# EAGLE design bat_charger (EAGLE 9.6.2)
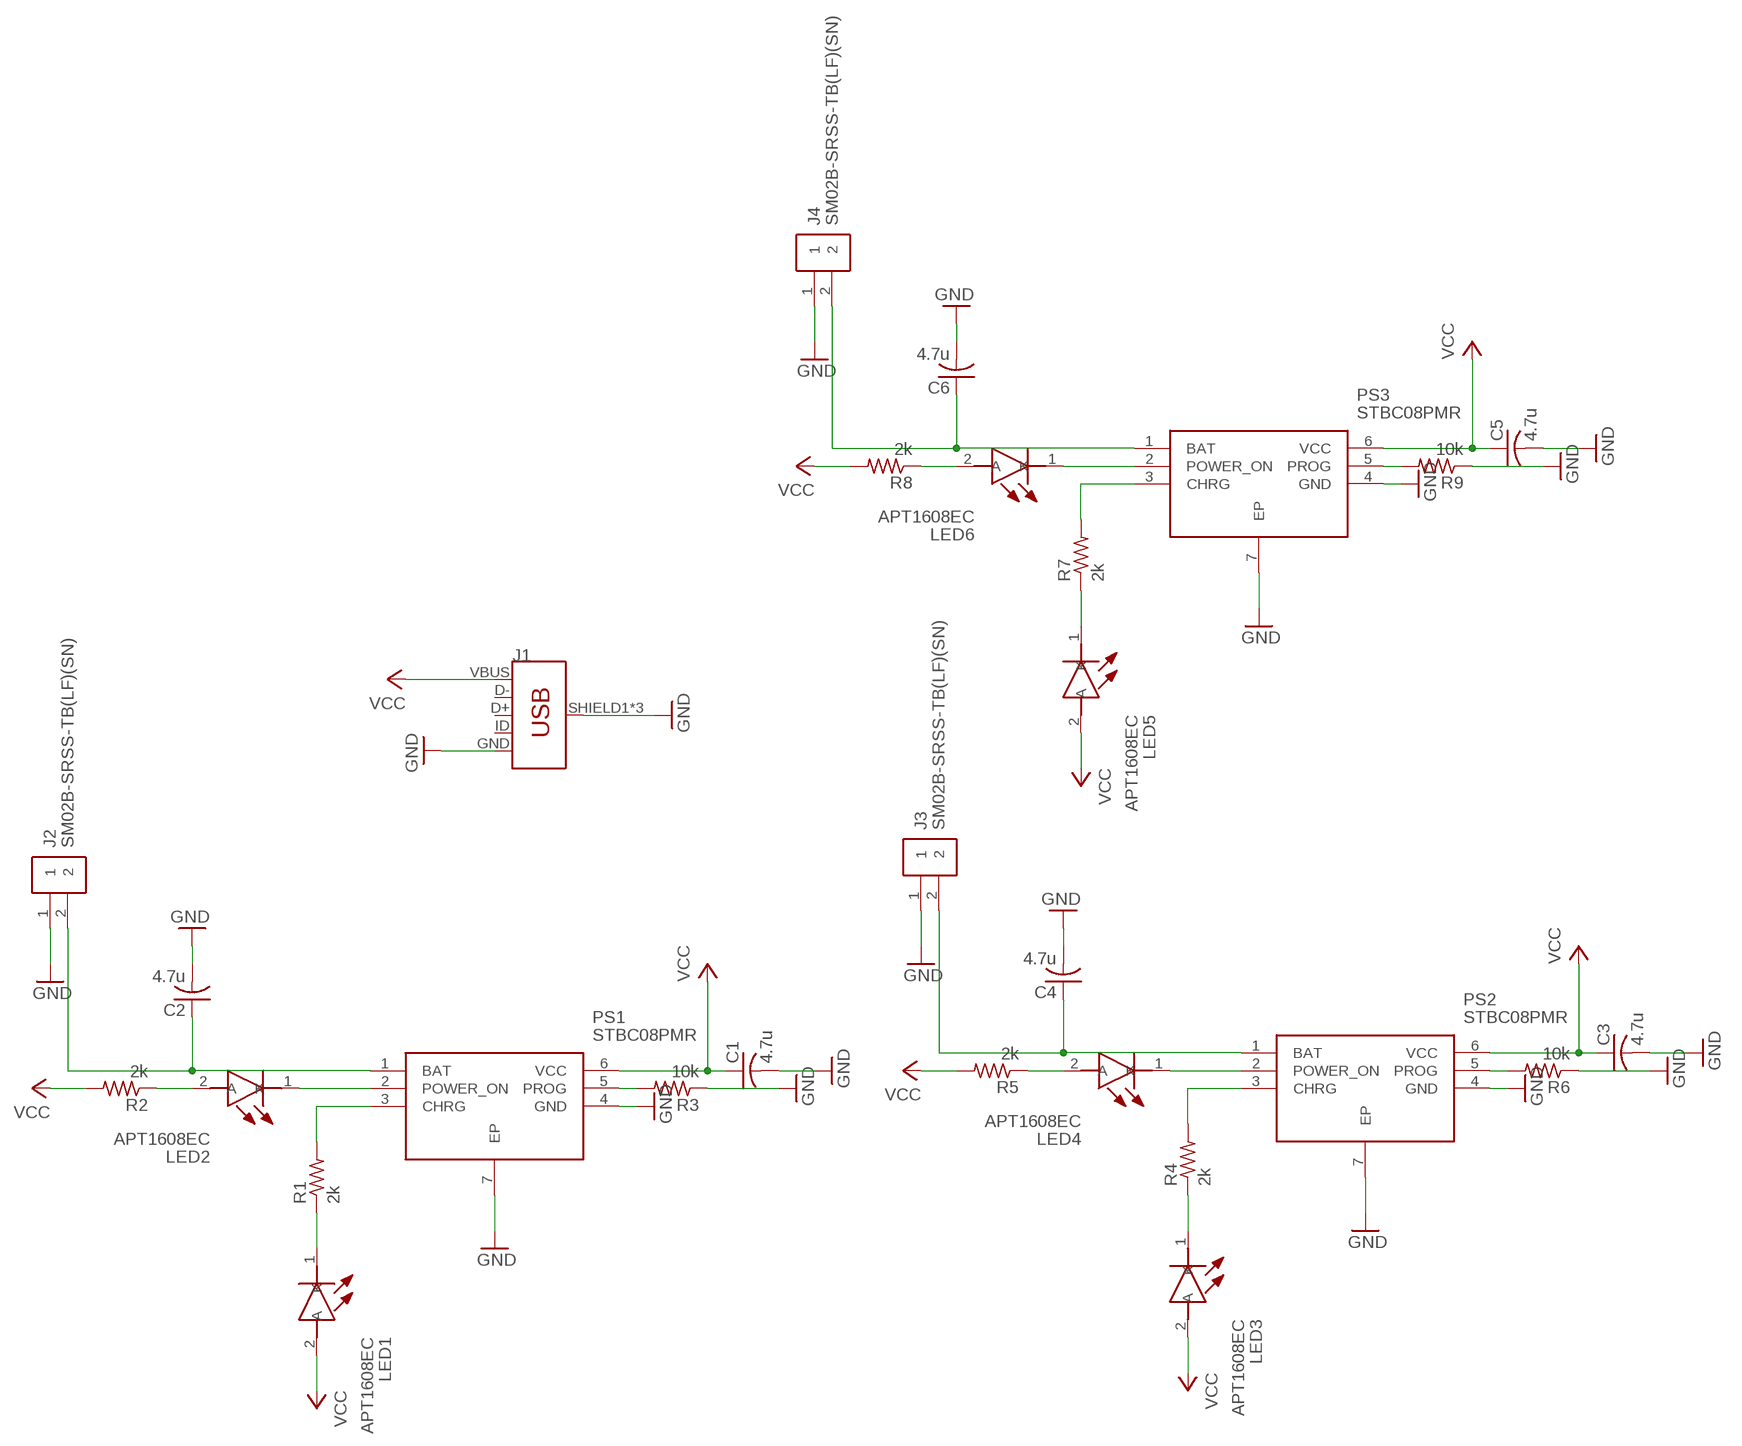
[diagram p0: schematic, sheet 1]

## Parts
C1  4.7u  C-USC0603  [C0603]
C2  4.7u  C-USC0603  [C0603]
C3  4.7u  C-USC0603  [C0603]
C4  4.7u  C-USC0603  [C0603]
C5  4.7u  C-USC0603  [C0603]
C6  4.7u  C-USC0603  [C0603]
J1  USB_MICRO-B_FEMALE-SMT  [USB-B-MICRO-SMD]
J2  SM02B-SRSS-TB(LF)(SN)  [SM02B-SRSS-TB(LF)(SN)]
J3  SM02B-SRSS-TB(LF)(SN)  [SM02B-SRSS-TB(LF)(SN)]
J4  SM02B-SRSS-TB(LF)(SN)  [SM02B-SRSS-TB(LF)(SN)]
LED1  APT1608EC  [LEDC1608X85N]
LED2  APT1608EC  [LEDC1608X85N]
LED3  APT1608EC  [LEDC1608X85N]
LED4  APT1608EC  [LEDC1608X85N]
LED5  APT1608EC  [LEDC1608X85N]
LED6  APT1608EC  [LEDC1608X85N]
PS1  STBC08PMR  [SON95P300X300X100-7N]
PS2  STBC08PMR  [SON95P300X300X100-7N]
PS3  STBC08PMR  [SON95P300X300X100-7N]
R1  2k  R-US_R0603  [R0603]
R2  2k  R-US_R0603  [R0603]
R3  10k  R-US_R0603  [R0603]
R4  2k  R-US_R0603  [R0603]
R5  2k  R-US_R0603  [R0603]
R6  10k  R-US_R0603  [R0603]
R7  2k  R-US_R0603  [R0603]
R8  2k  R-US_R0603  [R0603]
R9  10k  R-US_R0603  [R0603]

## Nets
GND [pwr]: C1.2 C2.2 C3.2 C4.2 C5.2 C6.2 J1.GND J1.SHIELD1(SHIELD) J1.SHIELD2(SHIELD) J1.SHIELD3(SHIELD) J2.1 J3.1 J4.1 PS1.4(GND) PS1.7(EP) PS2.4(GND) PS2.7(EP) PS3.4(GND) PS3.7(EP) R3.1 R6.1 R9.1
N$1: PS1.3(CHRG) R1.2
N$2: LED1.1(K) R1.1
N$3: C2.1 J2.2 PS1.1(BAT)
N$4: LED2.1(K) PS1.2(POWER_ON)
N$5: LED2.2(A) R2.1
N$6: PS1.5(PROG) R3.2
N$7: PS2.3(CHRG) R4.2
N$8: LED3.1(K) R4.1
N$9: LED4.1(K) PS2.2(POWER_ON)
N$10: LED4.2(A) R5.1
N$11: PS2.5(PROG) R6.2
N$12 [pwr]: C4.1 J3.2 PS2.1(BAT)
N$13: PS3.3(CHRG) R7.2
N$14: LED5.1(K) R7.1
N$15: LED6.1(K) PS3.2(POWER_ON)
N$16: LED6.2(A) R8.1
N$17: PS3.5(PROG) R9.2
N$18 [pwr]: C6.1 J4.2 PS3.1(BAT)
VCC [pwr]: C1.1 C3.1 C5.1 J1.VBUS LED1.2(A) LED3.2(A) LED5.2(A) PS1.6(VCC) PS2.6(VCC) PS3.6(VCC) R2.2 R5.2 R8.2
Unconnected: J1.D+ J1.D- J1.ID

## Library data of the parts
C1-C6 = adafruit:C-US: CAPACITOR, American symbol
J1 = SparkFun-Connectors:USB_MICRO-B: USB Type Micro-B Connector Male/female and PTH/SMT variants SparkFun Products: SparkFun microB USB Breakout <https://www.sparkfun.com/products/12035> SparkFun USB microB Plug Breakout <https://www.sparkfun.com/products/10031> SparkFun ESP8266 Thing <https://www.sparkfun.com/products/13231>; PROD_ID: CONN-11752
J2-J4 = SM02B-SRSS-TB_LF__SN_:SM02B-SRSS-TB(LF)(SN): JST (JAPAN SOLDERLESS TERMINALS) - SM02B-SRSS-TB (LF)(SN) - HEADER, R/A, 2WAY Source: Datasheet <http://www.jst-mfg.com/product/pdf/eng/eSH.pdf> Check availability <https://pricing.snapeda.com/parts/SM02B-SRSS-TB%28LF%29%28SN%29/JST%20Sales/view-part?ref=eda>; AVAILABILITY: In Stock; DESCRIPTION: Connector Header Surface Mount, Right Angle 2 position 0.039 (1.00mm); MF: JST Sales; MP: SM02B-SRSS-TB(LF)(SN); PACKAGE: None; PRICE: None; PURCHASE-URL: https://pricing.snapeda.com/search/part/SM02B-SRSS-TB(LF)(SN)/?ref=eda
LED1-LED6 = APT1608EC:APT1608EC: Standard LEDs - SMD HI EFF RED WTR CLR Source: Datasheet <http://docs-emea.rs-online.com/webdocs/142e/0900766b8142ead4.pdf>; ARROW_PART_NUMBER: APT1608EC; ARROW_PRICE-STOCK: https://www.arrow.com/en/products/apt1608ec/kingbright; DESCRIPTION: Standard LEDs - SMD HI EFF RED WTR CLR; HEIGHT: 0.85mm; MANUFACTURER_NAME: Kingbright; MANUFACTURER_PART_NUMBER: APT1608EC; MOUSER_PART_NUMBER: 604-APT1608EC; MOUSER_PRICE-STOCK: https://www.mouser.co.uk/ProductDetail/Kingbright/APT1608EC?qs=y3UkhjaxUTbvcINjaB1ATQ%3D%3D
PS1-PS3 = STBC08PMR:STBC08PMR: STMicroelectronics STBC08PMR, Battery Charger, 800mA, 6-Pin DFN Source: Datasheet <https://componentsearchengine.com/Datasheets/2/STBC08PMR.pdf>; ARROW_PART_NUMBER: STBC08PMR; ARROW_PRICE-STOCK: https://www.arrow.com/en/products/stbc08pmr/stmicroelectronics; DESCRIPTION: STMicroelectronics STBC08PMR, Battery Charger, 800mA, 6-Pin DFN; HEIGHT: 1mm; MANUFACTURER_NAME: STMicroelectronics; MANUFACTURER_PART_NUMBER: STBC08PMR; MOUSER_PART_NUMBER: 511-STBC08PMR; MOUSER_PRICE-STOCK: https://www.mouser.co.uk/ProductDetail/STMicroelectronics/STBC08PMR?qs=%252BFmDY%2FmH7Ia1jfeGRWsaYw%3D%3D
R1-R9 = adafruit:R-US_: RESISTOR, American symbol

## Net classes
1 pwr: width 0.254 mm

## Board
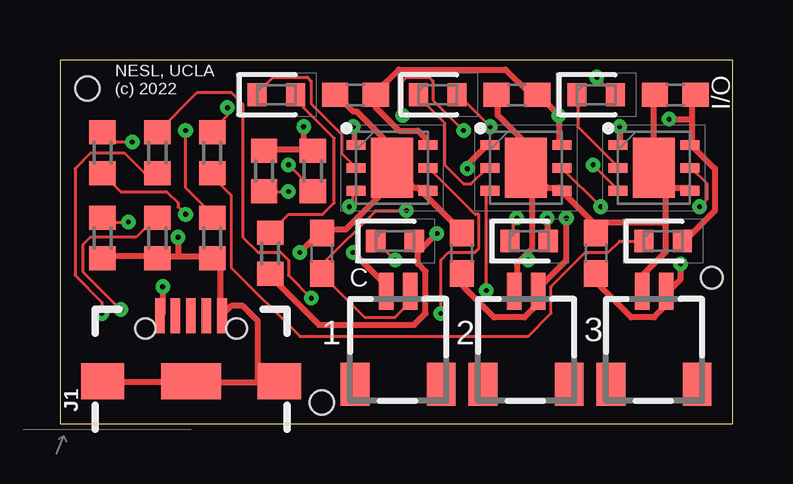
[diagram p1: board, top side]
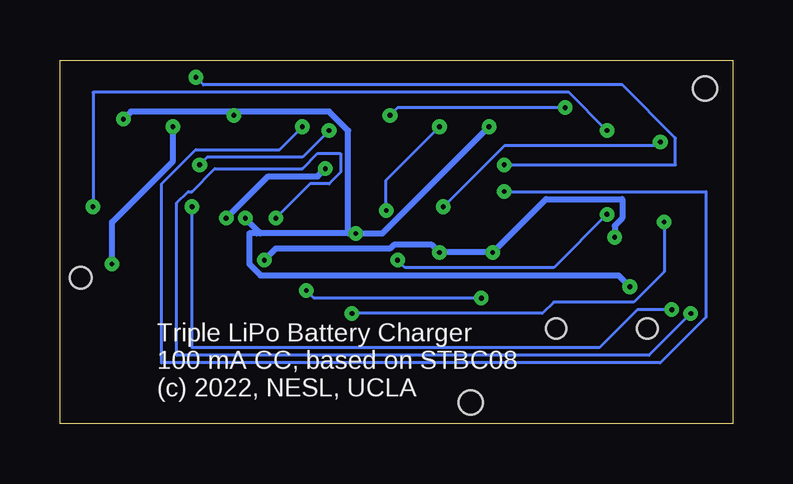
[diagram p2: board, bottom side, seen from below]

Size 28.05 x 15.16 mm. Coordinates in mm from the lower left corner, seen from the top.
Outline: 0,0 28.05,0 28.05,15.16 0,15.16 0,0
Copper layers (1*16): Top 0.035mm / dielectric 1.5mm / Bottom 0.035mm
Design rules "default *": minimum track width 5mil, minimum drill 0.2mm, track to track 5mil, track to pad 5mil, pad to pad 5mil, via to via 5mil, smd to smd 5mil, copper to edge 10mil, drill to drill 5mil, minimum pad ring 10mil, minimum via ring 8mil, stop-mask expansion 4mil, vias tented up to drill 0mil, thermal gap 10mil
Holes 0.9 mm at 27.18,6.1
Holes 1 mm at 1.14,13.97 10.92,0.89

### Footprints (pad centres in the part's own frame; a part is rotated, then mirrored left to right if it is on the bottom)
C0603 = smd 1.1 x 1: 1 -0.85,0; 2 0.85,0
USB-B-MICRO-SMD = smd 1.45 x 0.4: D+ 2.725,0; D- 2.725,0.65; GND 2.725,-1.3; ID 2.725,-0.65; VBUS 2.725,1.3 | smd 1.5 x 1.8: SHIELD1 0,3.685; SHIELD2 0,-3.685 | smd 1.5 x 2.5: SHIELD3 0,0 | hole 0.85: 2.2,1.9; 2.2,-1.9
SM02B-SRSS-TB(LF)(SN) = smd 0.6 x 1.55: 1 -0.5,1.975; 2 0.5,1.975 | smd 1.2 x 1.8: 3 -1.8,-1.9; 4 1.8,-1.9
LEDC1608X85N = smd 0.8 x 0.95: 1 -0.8,0; 2 0.8,0
SON95P300X300X100-7N = smd 0.8 x 0.4: 1 -1.5,0.95; 2 -1.5,0; 3 -1.5,-0.95; 4 1.5,-0.95; 5 1.5,0; 6 1.5,0.95 | smd 1.75 x 2.5: 7 0,0
R0603 = smd 1 x 1.1: 1 -0.85,0; 2 0.85,0

### Placement (x,y rotation side)
C1  12.32,13.72 180 top
C2  10.92,7.11 90 top
C3  19.05,13.72 180 top
C4  16.76,7.11 90 top
C5  25.65,13.72 180 top
C6  22.35,7.11 90 top
J1  5.46,1.78 90 top
J2  14.1,3.56 0 top
J3  19.43,3.56 0 top
J4  24.76,3.56 0 top
LED1  13.97,7.62 0 top
LED2  9.02,13.72 0 top
LED3  19.56,7.62 0 top
LED4  15.75,13.72 0 top
LED5  25.15,7.62 0 top
LED6  22.35,13.72 0 top
PS1  13.84,10.67 0 top
PS2  19.43,10.67 0 top
PS3  24.76,10.67 0 top
R1  1.78,11.3 90 top
R2  8.76,7.11 270 top
R3  1.78,7.75 90 top
R4  4.06,11.3 90 top
R5  8.51,10.54 90 top
R6  4.06,7.75 90 top
R7  6.35,11.3 90 top
R8  10.54,10.54 90 top
R9  6.35,7.75 90 top

### Tracks (layer width: path | path; a pad name or v marks a point on that pad's centre or on a via)
GND  (via drill 0.2)
  Top 0.254: PS3.4 26.19,9.84 25.56,9.84 24.76,10.64 PS3.7 | PS3.7 24.76,13.65 C5.2 | 25.24,8.41 25.24,10 PS3.7 | 25.24,8.41 25.24,7.14 24.29,6.19 24.29,5.56 J4.1 | PS2.7 19.53,10.64 20.32,9.84 20.8,9.84 PS2.4 20.95,9.68 22.22,8.41 | 22.22,8.41 22.22,8.1 C6.2 22.22,8.41 | C3.2 18.26,13.65 18.26,12.86 19.37,11.75 19.37,10.79 PS2.7 | 19.45,7.06 19.68,7.3 19.68,10.32 PS2.7 | 19.45,7.06 19.05,6.67 19.05,5.56 J3.1 | 22.22,8.41 25.24,8.41 | R3.1 1.91,6.99 3.97,6.99 R6.1 4.13,6.99 4.92,6.99 | 4.92,6.99 6.35,6.99 R9.1 6.35,6.83 6.67,6.51 6.67,4.6 J1.GND 6.83,4.6 7.14,4.92 7.62,4.92 8.26,4.29 8.26,1.75 | J1.SHIELD1 1.91,1.75 5.4,1.75 J1.SHIELD3 5.56,1.75 8.26,1.75 | 8.26,1.75 9.05,1.75 J1.SHIELD2 8.26,1.75 | 14.92,9.84 14.76,9.84 13.97,10.64 PS1.7 | 14.92,9.84 15.24,9.84 PS1.4 | PS1.7 14.13,10.32 11.91,8.1 10.95,8.1 C2.2 10.79,7.94 v10,7.14 | 14.92,9.84 16.67,8.1 C4.2 | C1.2 11.59,13.65 12.22,13.02 12.38,13.02 13.81,11.59 13.81,10.79 PS1.7 | v12.22,7.14 13.49,5.87 13.49,5.56 J2.1 | v4.92,7.78 4.92,6.99 | v19.53,6.83 19.53,6.99 19.45,7.06
  Bottom 0.254: v4.92,7.78 4.92,8.26 4.6,8.57 4.6,9.37 7.78,9.37 v10,7.14 v12.22,7.14 12.54,7.46 14.13,7.46 14.29,7.3 19.05,7.3 v19.53,6.83
N$1  (via drill 0.2)
  Top 0.127: v12.06,9.05 12.22,9.21 12.22,9.68 PS1.3 | v3.02,11.75 2.22,11.75 1.91,12.06 R1.2
  Bottom 0.127: v12.06,9.05 9.53,11.59 3.17,11.59 v3.02,11.75
N$2  (via drill 0.2)
  Top 0.127: v13.97,6.83 LED1.1 | v5.24,8.73 4.92,9.05 4.92,9.21 4.45,9.68 2.54,9.68 1.91,10.32 R1.1
  Bottom 0.127: v13.97,6.83 13.65,6.51 7.46,6.51 v5.24,8.73
N$3  (via drill 0.2)
  Top 0.127: v12.22,12.38 12.22,11.75 PS1.1 | v14.45,8.89 13.18,8.89 10.95,6.67 10.95,6.35 C2.1 10.95,6.19 12.7,4.45 13.97,4.45 14.45,4.92 14.45,5.4 J2.2
  Bottom 0.127: v12.22,12.38 14.45,10.16 v14.45,8.89
N$4
  Top 0.127: PS1.2 12.22,10.79 11.75,11.27 11.75,12.06 10.48,13.34 10.48,14.29 10.32,14.45 8.89,14.45 8.26,13.81 LED2.1
N$5
  Top 0.127: LED2.2 9.84,13.65 10.16,13.34 10.16,13.18 11.43,11.91 11.43,9.21 10.95,8.73 9.53,8.73 8.89,8.1 R2.1
N$6  (via drill 0.2)
  Top 0.127: v15.88,4.6 15.88,6.83 16.19,7.14 17.3,7.14 17.46,7.3 17.46,8.73 17.3,8.73 15.4,10.64 PS1.5 | v2.86,8.41 2.06,8.41 1.91,8.57 R3.2
  Bottom 0.127: v15.88,4.6 7.94,4.6 7.46,5.08 4.13,5.08 2.86,6.35 v2.86,8.41
N$7  (via drill 0.2)
  Top 0.127: v17.78,5.56 17.78,9.68 PS2.3 | v10.48,5.24 9.53,6.19 9.53,6.83 9.21,7.14 8.26,7.14 7.62,7.78 7.62,13.34 7.14,13.81 5.71,13.81 4.13,12.22 R4.2
  Bottom 0.127: v17.78,5.56 17.46,5.24 v10.48,5.24
N$8  (via drill 0.2)
  Top 0.127: v19.05,8.57 18.89,8.41 18.89,7.62 LED3.1 | v1.75,4.6 1.75,5.08 0.64,6.19 0.64,10.64 1.27,11.27 2.7,11.27 3.49,10.48 3.97,10.48 R4.1
  Bottom 0.127: v19.05,8.57 17.62,10 16.83,10 16.35,10.48 16.35,11.27 17.3,11.27 17.94,10.64 21.59,10.64 22.54,9.68 22.7,9.68 23.18,9.21 23.18,2.86 3.49,2.86 v1.75,4.6
N$9
  Top 0.127: PS2.2 17.78,10.64 17.14,10 16.83,10 16.03,10.79 16.03,12.54 14.92,13.65 LED4.1
N$10  (via drill 0.2)
  Top 0.127: v17.94,12.38 16.67,13.65 LED4.2 | v9.53,9.68 8.57,9.68 R5.1
  Bottom 0.127: v17.94,12.38 18.89,11.43 22.38,11.43 23.81,10 23.81,2.54 3.02,2.54 1.11,4.45 1.11,9.68 v9.53,9.68
N$11  (via drill 0.2)
  Top 0.127: v22.54,9.05 20.95,10.64 PS2.5 | v2.54,4.76 0.95,6.35 0.95,7.46 1.27,7.78 3.17,7.78 3.97,8.57 R6.2
  Bottom 0.127: v22.54,9.05 22.54,3.17 5.56,3.17 3.97,4.76 v2.54,4.76
N$12  (via drill 0.2)
  Top 0.254: v16.99,10.64 16.99,10.79 17.78,11.59 PS2.1 | v21.11,8.57 21.11,6.83 19.84,5.56 J3.2 19.84,5.4 19.84,4.92 19.37,4.45 18.1,4.45 16.83,5.71 16.83,6.19 C4.1
  Bottom 0.254: v16.99,10.64 17.3,10.32 19.37,10.32 v21.11,8.57
N$13  (via drill 0.2)
  Top 0.127: v22.22,10.79 23.18,9.84 PS3.3 | v16.83,12.22 15.56,13.49 15.56,14.29 15.4,14.45 14.45,14.45 14.29,14.29 v14.29,12.86 | v6.99,13.18 6.99,12.86 6.35,12.22 R7.2
  Bottom 0.127: v22.22,10.79 21.91,11.11 17.94,11.11 v16.83,12.22 | v14.29,12.86 13.97,13.18 v6.99,13.18
N$14
  Top 0.127: LED5.1 23.34,7.62 22.86,7.14 21.91,7.14 20.48,5.71 20.48,4.6 19.53,3.65 10,3.65 7.14,6.51 7.14,9.53 6.35,10.32 R7.1
N$15
  Top 0.127: PS3.2 23.18,10.79 21.59,12.38 21.59,13.65 LED6.1
N$16  (via drill 0.2)
  Top 0.127: v22.38,14.45 23.02,13.81 LED6.2 | v9.53,10.79 10.48,9.84 R8.1
  Bottom 0.127: v22.38,14.45 22.07,14.13 4.6,14.13 2.38,11.91 2.38,10.79 v9.53,10.79
N$17  (via drill 0.2)
  Top 0.127: v26.67,9.05 26.99,9.37 26.99,10 26.35,10.64 PS3.5 | v5.24,12.22 5.24,9.84 6.35,8.73 R9.2
  Bottom 0.127: v26.67,9.05 26.67,13.81 6.83,13.81 v5.24,12.22
N$18  (via drill 0.2)
  Top 0.254: v23.34,12.38 23.34,11.75 PS3.1 | v25.88,6.67 25.88,6.03 25.4,5.56 J4.2 25.24,5.4 25.24,4.92 24.76,4.45 23.81,4.45 22.38,5.87 22.38,6.19 C6.1
  Bottom 0.254: v23.34,12.38 23.34,10.95 25.88,8.41 v25.88,6.67
VCC  (via drill 0.2)
  Top 0.254: PS2.6 20.8,11.75 v20.8,12.86 20,13.65 C3.1 19.84,13.81 19.53,13.81 18.57,14.76 14.13,14.76 13.18,13.81 C1.1 13.18,13.65 13.18,13.18 14.13,12.22 14.92,12.22 15.24,11.91 15.24,11.75 PS1.6 | 26.35,12.7 26.35,13.65 C5.1 | 26.35,12.7 26.35,11.75 PS3.6 26.35,11.59 27.3,10.64 27.3,8.89 26.04,7.62 LED5.2 | 10.16,11.43 10.48,11.43 R8.2 10.16,11.43 | 10.16,11.43 8.57,11.43 R5.2 | 14.92,7.14 14.92,6.67 15.24,6.35 15.24,4.6 14.76,4.13 10.79,4.13 8.73,6.19 R2.2 | 14.92,7.14 14.92,7.62 LED1.2 | v20.32,8.57 20.32,7.62 LED3.2 | 14.92,7.14 v15.72,7.94 | v4.29,5.71 4.29,4.6 J1.VBUS | v10.16,12.38 10.16,11.43 | v25.4,12.7 26.35,12.7
  Bottom 0.254: 19.76,8.02 19.68,7.94 16.03,7.94 | 19.76,8.02 v20.32,8.57 | 16.03,7.94 v15.72,7.94 14.61,7.94 v10.16,12.38 | v4.29,5.71 4.76,6.19 19.68,6.19 20.16,6.67 20.16,7.94 19.84,7.94 19.76,8.02 | v25.4,12.7 25.08,13.02 20.8,13.02 | 20.8,13.02 16.83,13.02 16.03,12.22 16.03,7.94 | 20.8,13.02 v20.8,12.86

### Text on the board
tNames: NESL, UCLA / (c) 2022 | I/O | C | 1 | 2 | 3
bNames: Triple LiPo Battery Charger / 100 mA CC, based on STBC08 / (c) 2022, NESL, UCLA